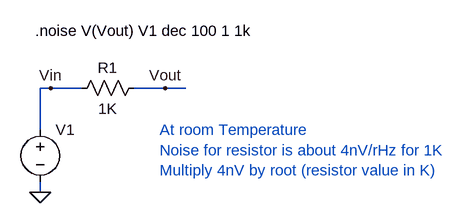
[diagram p0: schematic Resistor Noise.asc]
Resistor Noise.asc, the LTspice schematic file:
Version 4
SHEET 1 880 680
WIRE 64 128 48 128
WIRE 112 128 64 128
WIRE 240 128 192 128
WIRE 272 128 240 128
WIRE 48 192 48 128
WIRE 48 288 48 272
FLAG 48 288 0
FLAG 240 128 Vout
FLAG 64 128 Vin
SYMBOL voltage 48 176 R0
WINDOW 123 0 0 Left 2
WINDOW 39 0 0 Left 2
SYMATTR InstName V1
SYMATTR Value ""
SYMBOL res 208 112 R90
WINDOW 0 0 56 VBottom 2
WINDOW 3 32 56 VTop 2
SYMATTR InstName R1
SYMATTR Value 1K
TEXT 40 40 Left 2 !.noise V(Vout) V1 dec 100 1 1k
TEXT 232 192 Left 2 ;At room Temperature\nNoise for resistor is about 4nV/rHz for 1K\nMultiply 4nV by root (resistor value in K)

The netlist it stands for:
* Resistor Noise.asc
V1 Vin 0
R1 Vout Vin 1K
.noise V(Vout) V1 dec 100 1 1k
* At room Temperature
* Noise for resistor is about 4nV/rHz for 1K
* Multiply 4nV by root (resistor value in K)
.backanno
.end